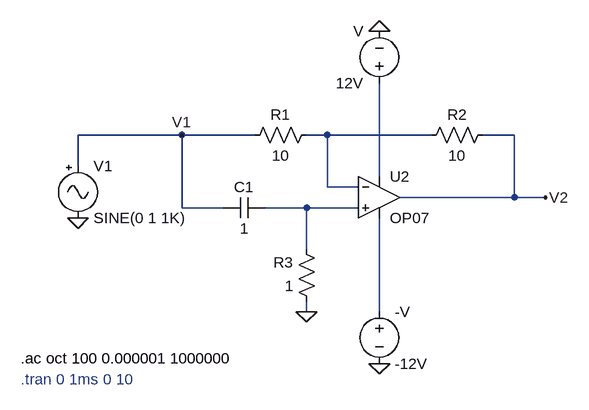
[diagram p0: schematic TS1 Bonus copy.asc]
TS1 Bonus copy.asc, the LTspice schematic file:
Version 4
SHEET 1 880 680
WIRE 48 208 -112 208
WIRE 160 208 48 208
WIRE 272 208 240 208
WIRE 432 208 272 208
WIRE 560 208 512 208
WIRE -112 256 -112 208
WIRE 352 272 352 128
WIRE 272 288 272 208
WIRE 320 288 272 288
WIRE 560 304 560 208
WIRE 560 304 384 304
WIRE 608 304 560 304
WIRE 48 320 48 208
WIRE 112 320 48 320
WIRE 240 320 176 320
WIRE 320 320 240 320
WIRE 240 384 240 320
WIRE 240 480 240 464
WIRE 352 480 352 336
FLAG 240 480 0
FLAG -112 336 0
FLAG 608 304 V2
FLAG 48 208 V1
FLAG 352 48 0
FLAG 352 560 0
SYMBOL Res 528 192 R90
WINDOW 0 0 56 VBottom 2
WINDOW 3 32 56 VTop 2
SYMATTR InstName R2
SYMATTR Value 10
SYMBOL res 256 192 R90
WINDOW 0 0 56 VBottom 2
WINDOW 3 32 56 VTop 2
SYMATTR InstName R1
SYMATTR Value 10
SYMBOL res 256 480 R180
WINDOW 0 36 76 Left 2
WINDOW 3 36 40 Left 2
SYMATTR InstName R3
SYMATTR Value 1
SYMBOL cap 176 304 R90
WINDOW 0 0 32 VBottom 2
WINDOW 3 32 32 VTop 2
SYMATTR InstName C1
SYMATTR Value 1
SYMBOL Misc/signal -112 240 R0
SYMATTR InstName V1
SYMATTR Value2 AC 1
SYMBOL OpAmps/OP07 352 240 R0
SYMATTR InstName U2
SYMBOL voltage 352 464 R0
SYMATTR InstName -V
SYMATTR Value -12V
SYMBOL voltage 352 144 R180
WINDOW 0 24 96 Left 2
WINDOW 3 24 16 Left 2
SYMATTR InstName V
SYMATTR Value 12V
TEXT -200 552 Left 2 !.ac oct 100 0.000001 1000000
TEXT -200 584 Left 2 ;.tran 0 1ms 0 10

The netlist it stands for:
* TS1 Bonus copy.asc
R2 V2 N001 10
R1 N001 V1 10
R3 0 N003 1
C1 N003 V1 1
V1 V1 0 SINE(0 1 1K) AC 1
XU2 N003 N001 N002 N004 V2 LT1001  ; OP07, pins In+ In- V+ V- OUT
V§-V N004 0 -12V
V N002 0 12V
.ac oct 100 0.000001 1000000
* .tran 0 1ms 0 10
.lib LTC.lib
.backanno
.end